# Altium schematic sheet LTC6804-2_BMS_TR.SchDoc
size A4; SheetNumber: 2; SheetTotal: 7
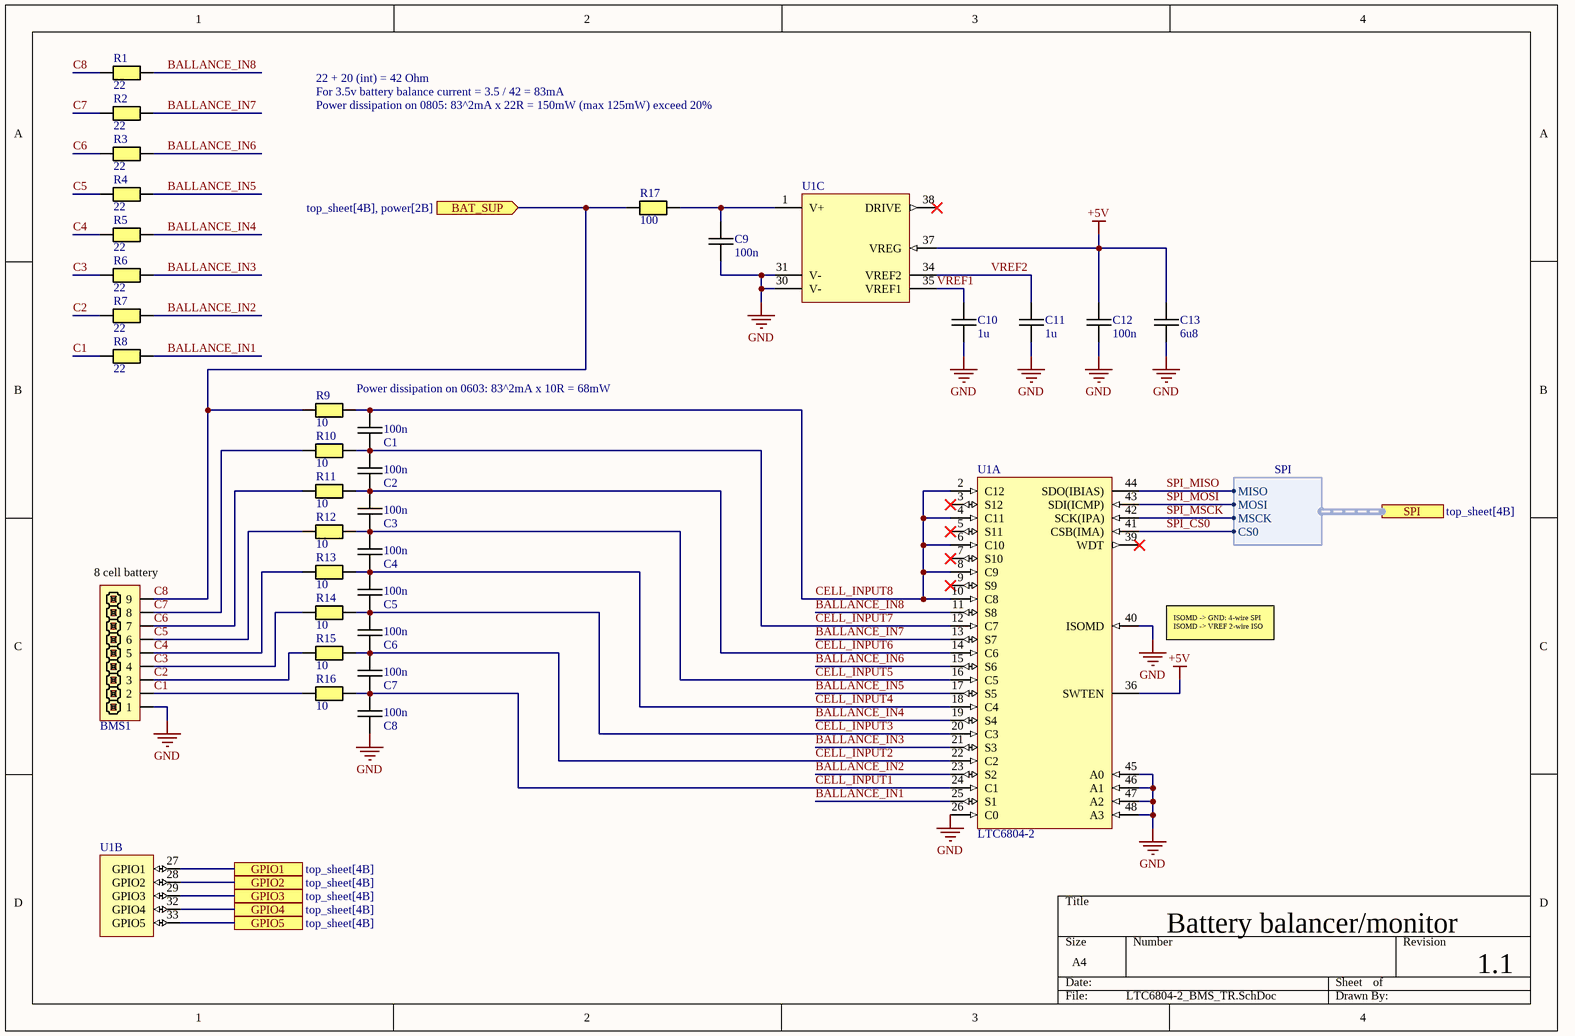
[diagram p0: LTC6804-2_BMS_TR.SchDoc]

## Parts
BMS1  PIN HEADER 1x9  [XH2.54 9P]  (value not drawn)
C1  100n  [CAPC0603(1608)55_N]
C2  100n  [CAPC0603(1608)55_N]
C3  100n  [CAPC0603(1608)55_N]
C4  100n  [CAPC0603(1608)55_N]
C5  100n  [CAPC0603(1608)55_N]
C6  100n  [CAPC0603(1608)55_N]
C7  100n  [CAPC0603(1608)55_N]
C8  100n  [CAPC0603(1608)55_N]
C9  100n  [CAPC0603(1608)55_N]
C10  1u  [CAPC0805(2012)75_N]
C11  1u  [CAPC0805(2012)75_N]
C12  100n  [CAPC0603(1608)55_N]
C13  6u8  [CAPC0805(2012)75_N]
R1  22  [RESC0805(2012)_N]
R2  22  [RESC0805(2012)_N]
R3  22  [RESC0805(2012)_N]
R4  22  [RESC0805(2012)_N]
R5  22  [RESC0805(2012)_N]
R6  22  [RESC0805(2012)_N]
R7  22  [RESC0805(2012)_N]
R8  22  [RESC0805(2012)_N]
R9  10  [RESC0603(1608)_N]
R10  10  [RESC0603(1608)_N]
R11  10  [RESC0603(1608)_N]
R12  10  [RESC0603(1608)_N]
R13  10  [RESC0603(1608)_N]
R14  10  [RESC0603(1608)_N]
R15  10  [RESC0603(1608)_N]
R16  10  [RESC0603(1608)_N]
R17  100  [RESC0603(1608)_N]
U1  LTC6804-2  [SSOP48]  (parts A,B,C of 3)

## Ports
BAT_SUP (in, see top_sheet[4B], power[2B]), GPIO1 (see top_sheet[4B]), GPIO2 (see top_sheet[4B]), GPIO3 (see top_sheet[4B]), GPIO4 (see top_sheet[4B]), GPIO5 (see top_sheet[4B]), SPI (harness SPI, see top_sheet[4B])

## Harnesses
SPI: MSCK, MOSI, MISO, CS0

## Nets
+5V: C12.1 C13.1 U1.36(SWTEN) U1.37(VREG)
GND: BMS1.1 C8.2 C9.2 C10.2 C11.2 C12.2 C13.2 U1.26(C0) U1.30(V-) U1.31(V-) U1.40(ISOMD) U1.45(A0) U1.46(A1) U1.47(A2) U1.48(A3)
BALLANCE_IN1: R8.2 U1.25(S1)
BALLANCE_IN2: R7.2 U1.23(S2)
BALLANCE_IN3: R6.2 U1.21(S3)
BALLANCE_IN4: R5.2 U1.19(S4)
BALLANCE_IN5: R4.2 U1.17(S5)
BALLANCE_IN6: R3.2 U1.15(S6)
BALLANCE_IN7: R2.2 U1.13(S7)
BALLANCE_IN8: R1.2 U1.11(S8)
C1: BMS1.2 R8.1 R16.1
C2: BMS1.3 R7.1 R15.1
C3: BMS1.4 R6.1 R14.1
C4: BMS1.5 R5.1 R13.1
C5: BMS1.6 R4.1 R12.1
C6: BMS1.7 R3.1 R11.1
C7: BMS1.8 R2.1 R10.1
C8: BMS1.9 R1.1 R9.1 R17.1 ; port BAT_SUP
CELL_INPUT1: C7.2 C8.1 R16.2 U1.24(C1)
CELL_INPUT2: C6.2 C7.1 R15.2 U1.22(C2)
CELL_INPUT3: C5.2 C6.1 R14.2 U1.20(C3)
CELL_INPUT4: C4.2 C5.1 R13.2 U1.18(C4)
CELL_INPUT5: C3.2 C4.1 R12.2 U1.16(C5)
CELL_INPUT6: C2.2 C3.1 R11.2 U1.14(C6)
CELL_INPUT7: C1.2 C2.1 R10.2 U1.12(C7)
CELL_INPUT8: C1.1 R9.2 U1.2(C12) U1.4(C11) U1.6(C10) U1.8(C9) U1.10(C8)
GPIO1: U1.27(GPIO1) ; port GPIO1
GPIO2: U1.28(GPIO2) ; port GPIO2
GPIO3: U1.29(GPIO3) ; port GPIO3
GPIO4: U1.32(GPIO4) ; port GPIO4
GPIO5: U1.33(GPIO5) ; port GPIO5
SPI_CS0: U1.41(CSB(IMA)) ; port SPI.CS0
SPI_MISO: U1.44(SDO(IBIAS)) ; port SPI.MISO
SPI_MOSI: U1.43(SDI(ICMP)) ; port SPI.MOSI
SPI_MSCK: U1.42(SCK(IPA)) ; port SPI.MSCK
VREF1: C10.1 U1.35(VREF1)
VREF2: C11.1 U1.34(VREF2)
NetC9_1: C9.1 R17.2 U1.1(V+)

Not connected (* = marked no-connect by the designer): U1 3(S12)* 5(S11)* 7(S10)* 9(S9)* 38(DRIVE)* 39(WDT)*

## Notes on the sheet
- 22 + 20 (int) = 42 Ohm
- For 3.5v battery balance current = 3.5 / 42 = 83mA
- Power dissipation on 0805: 83^2mA x 22R = 150mW (max 125mW) exceed 20%
- Power dissipation on 0603: 83^2mA x 10R = 68mW
- (near BMS1) 8 cell battery
- ISOMD -> GND: 4-wire SPI
  ISOMD -> VREF 2-wire ISO
- Battery balancer/monitor
- 1.1

## Library data of the parts
BMS1 = PIN HEADER 2.54 1x9
C1-C13 = Capacitor M: Ceramic capacitor Medium density
  C1-C9 C12: Value: 100n
  C10 C11: Value: 1u
  C13: Value: 6u8
R1-R17 = Resistor M: Resistor Medium Density
  R1-R8: Value: 22
  R9-R16: Value: 10
  R17: Value: 100
U1 = LTC6804-2: The LTC®6804 is a 3rd generation multicell battery stack / monitor that measures up to 12 series connected battery / cells with a total measurement error of less than 1.2mV. The / cell measurement range of 0V to 5V makes the LTC6804 / suitable for most battery chemistries. All 12 cell voltages / can be captured in 290µs, and lower data acquisition rates / can be selected for high noise reduction.